# Altium schematic sheet Motors and Steering.SchDoc
size A; SheetNumber: 4; SheetTotal: 4
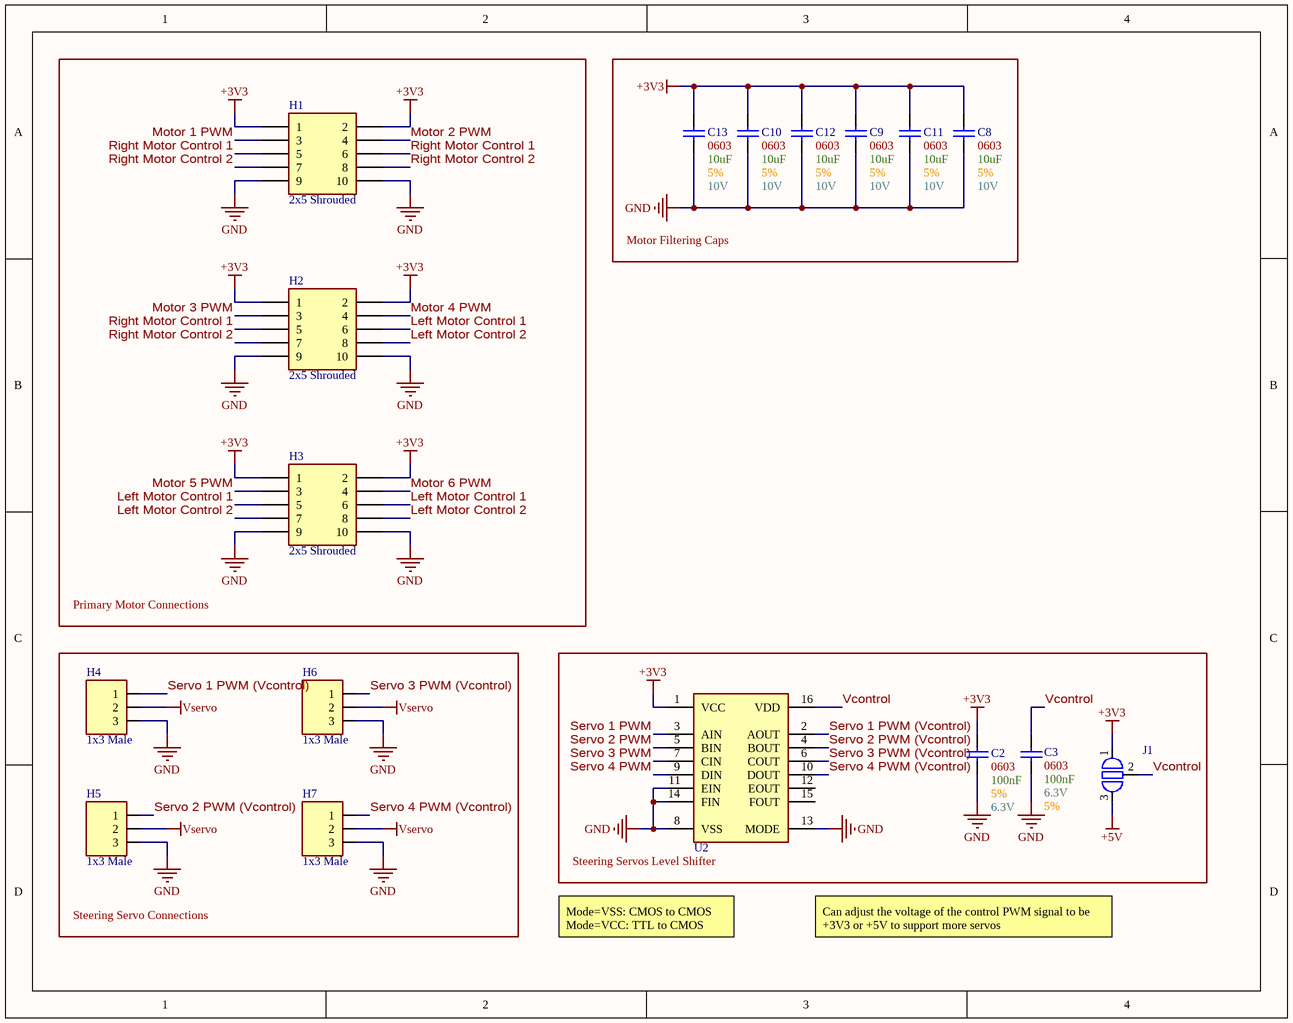
[diagram p0: Motors and Steering.SchDoc]

## Parts
C2  Size Package: 0603  Capacitance: 100nF  Voltage: 6.3V  Tolerance: 5%  [[Cap] SMD 0603]  (hidden comment: [Cap] SMD Nonpolarized)
C3  Size Package: 0603  Capacitance: 100nF  Voltage: 6.3V  Tolerance: 5%  [[Cap] SMD 0603]  (hidden comment: [Cap] SMD Nonpolarized)
C8  Size Package: 0603  Capacitance: 10uF  Voltage: 10V  Tolerance: 5%  [[Cap] SMD 0603]  (hidden comment: [Cap] SMD Nonpolarized)
C9  Size Package: 0603  Capacitance: 10uF  Voltage: 10V  Tolerance: 5%  [[Cap] SMD 0603]  (hidden comment: [Cap] SMD Nonpolarized)
C10  Size Package: 0603  Capacitance: 10uF  Voltage: 10V  Tolerance: 5%  [[Cap] SMD 0603]  (hidden comment: [Cap] SMD Nonpolarized)
C11  Size Package: 0603  Capacitance: 10uF  Voltage: 10V  Tolerance: 5%  [[Cap] SMD 0603]  (hidden comment: [Cap] SMD Nonpolarized)
C12  Size Package: 0603  Capacitance: 10uF  Voltage: 10V  Tolerance: 5%  [[Cap] SMD 0603]  (hidden comment: [Cap] SMD Nonpolarized)
C13  Size Package: 0603  Capacitance: 10uF  Voltage: 10V  Tolerance: 5%  [[Cap] SMD 0603]  (hidden comment: [Cap] SMD Nonpolarized)
H1  2x5 Shrouded  [[Header] Shrouded 2x5 Male]
H2  2x5 Shrouded  [[Header] Shrouded 2x5 Male]
H3  2x5 Shrouded  [[Header] Shrouded 2x5 Male]
H4  1x3 Male  [[Header] Shrouded 1x3 Male]
H5  1x3 Male  [[Header] Shrouded 1x3 Male]
H6  1x3 Male  [[Header] Shrouded 1x3 Male]
H7  1x3 Male  [[Header] Shrouded 1x3 Male]
J1  Thru-Hole Jumper  [[Jumper] Thru-Hole 3pin]  (value not drawn)
U2  [IC] Level Shifter Unidirectional 3-18V  [[IC] Level Shifter Unidirectional 3-18V]  (value not drawn)

## Blocks framed on the sheet
Primary Motor Connections: H1-H3
Motor Filtering Caps: C8-C13
Steering Servo Connections: H4-H7
Steering Servos Level Shifter: C2 C3 J1 U2

## Nets
+3V3: C2.2 C8.2 C9.2 C10.2 C11.2 C12.2 C13.2 H1.1 H1.2 H2.1 H2.2 H3.1 H3.2 J1.1 U2.1(VCC)
+5V: J1.3
GND: C2.1 C3.2 C8.1 C9.1 C10.1 C11.1 C12.1 C13.1 H1.9 H1.10 H2.9 H2.10 H3.9 H3.10 H4.3 H5.3 H6.3 H7.3 U2.8(VSS) U2.11(EIN) U2.13(MODE) U2.14(FIN)
Vservo: H4.2 H5.2 H6.2 H7.2
Left Motor Control 1: H2.6 H3.5 H3.6
Left Motor Control 2: H2.8 H3.7 H3.8
Motor 1 PWM: H1.3
Motor 2 PWM: H1.4
Motor 3 PWM: H2.3
Motor 4 PWM: H2.4
Motor 5 PWM: H3.3
Motor 6 PWM: H3.4
Right Motor Control 1: H1.5 H1.6 H2.5
Right Motor Control 2: H1.7 H1.8 H2.7
Servo 1 PWM: U2.3(AIN)
Servo 1 PWM (Vcontrol): H4.1 U2.2(AOUT)
Servo 2 PWM: U2.5(BIN)
Servo 2 PWM (Vcontrol): H5.1 U2.4(BOUT)
Servo 3 PWM: U2.7(CIN)
Servo 3 PWM (Vcontrol): H6.1 U2.6(COUT)
Servo 4 PWM: U2.9(DIN)
Servo 4 PWM (Vcontrol): H7.1 U2.10(DOUT)
Vcontrol: C3.1 J1.2(Common) U2.16(VDD)

Not connected (* = marked no-connect by the designer): U2 12(EOUT) 15(FOUT)

## Notes on the sheet
- Mode=VSS: CMOS to CMOS
  Mode=VCC: TTL to CMOS
- Can adjust the voltage of the control PWM signal to be +3V3 or +5V to support more servos

## Library data of the parts
H1-H3 = [Header] Shrouded 2x5 Male: BHR-10-VUA; Supplier 1: DigiKey; Supplier Part Number 1: 2057-BHR-10-VUA-ND
H4-H7 = [Header] Shrouded 1x3 Male: 070543-0037 / Mates with 005057-9403; Supplier 1: DigiKey; Supplier 2: DigiKey; Supplier Part Number 1: WM4825-ND; Supplier Part Number 2: WM2901-ND
J1 = [Jump] Thru-Hole 3pin: Clip Jumper; NO/NC: 2,3 NC
U2 = [IC] Level Shifter Unidirectional 3-18V: MC14504BDTR2G; Supplier 1: DigiKey; Supplier Part Number 1: MC14504BDTR2GOSCT-ND
C2 C3 C8-C13 = [Cap] SMD Nonpolarized: Supplier 1: DigiKey
  C2 C3: Supplier Part Number 1: 311-1088-6-ND
  C8-C13: Supplier Part Number 1: 1276-1192-1-ND